# Altium project Analog.PrjPcb
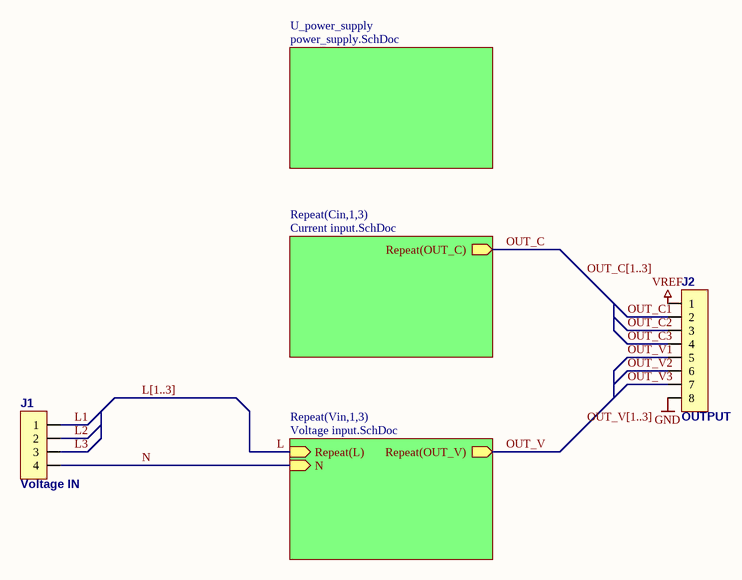
[diagram p0: main.SchDoc]
4 sheets, 89 parts. Net scope: hierarchical (ports join the sheet entries above them; power ports are global).
Sheets:
  main.SchDoc
    Cin1 = Current input.SchDoc
    Cin2 = Current input.SchDoc
    Cin3 = Current input.SchDoc
    U_power_supply = power_supply.SchDoc
    Vin1 = Voltage input.SchDoc
    Vin2 = Voltage input.SchDoc
    Vin3 = Voltage input.SchDoc

## Sheet main.SchDoc
size A4

### Parts
J1  Voltage IN  [2EDGRC-5.0-4P_WO_CN]
J2  OUTPUT  [GP_8x1]

### Sub-sheets
Repeat(Cin,1,3) = Current input.SchDoc: Repeat(OUT_C) (out)
Repeat(Vin,1,3) = Voltage input.SchDoc: Repeat(L) (in), N (in), Repeat(OUT_V) (out)
U_power_supply = power_supply.SchDoc: no entries

### Nets
GND: J2.8
VREF: J2.1
L: sheet Repeat(Vin,1,3)/Repeat(L)
L1: J1.1
L2: J1.2
L3: J1.3
N: J1.4 ; sheet Repeat(Vin,1,3)/N
OUT_C: sheet Repeat(Cin,1,3)/Repeat(OUT_C)
OUT_C1: J2.2
OUT_C2: J2.3
OUT_C3: J2.4
OUT_V: sheet Repeat(Vin,1,3)/Repeat(OUT_V)
OUT_V1: J2.5
OUT_V2: J2.6
OUT_V3: J2.7

### Buses and harness runs
bus L[1..3]
bus OUT_C[1..3]
bus OUT_V[1..3]

### Library data of the parts
J1 = 2EDGRC-5.0-4P: Degson 20A, 320V, 4 Pole Plug-in Terminal Block
J2 = CN_8x1

## Sheet Current input.SchDoc
size A4
Used 3 times, as channels Cin1, Cin2, Cin3. Parts and nets are listed once, with the designators drawn on the sheet.
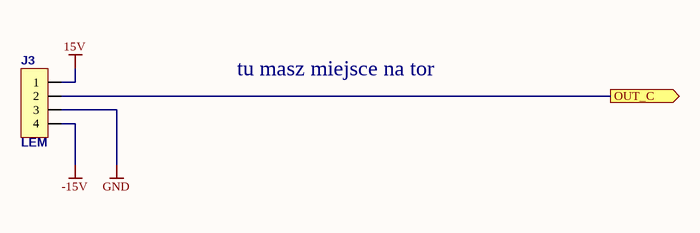
[diagram p1: Current input.SchDoc]

### Parts
J3  LEM  [15EDGRC-3.5/4P_WO_CN]

### Ports
OUT_C (out)

### Nets
15V: J3.1
-15V: J3.4
GND: J3.3
OUT_C: J3.2 ; port OUT_C

### Channels
Cin1: designators end in _Cin1; ports OUT_C=OUT_C1
Cin2: designators end in _Cin2; ports OUT_C=OUT_C2
Cin3: designators end in _Cin3; ports OUT_C=OUT_C3

### Notes on the sheet
- tu masz miejsce na tor

### Library data of the parts
J3 = 15EDGRC-3.5/4P: Degson 7A, 250V, 4 Pole Plug-in Terminal Block

## Sheet power_supply.SchDoc
size A4
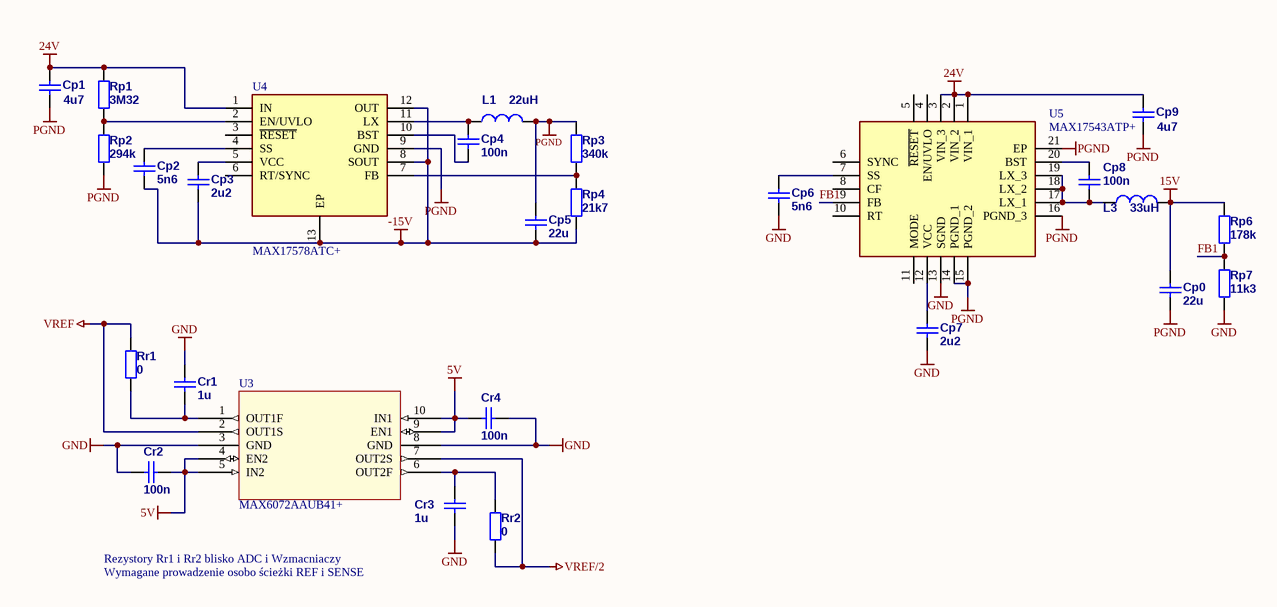
[diagram p2: power_supply.SchDoc]

### Parts
Cp0  22u  [C1206]
Cp1  4u7  [C1206]
Cp2  5n6  [C0603]
Cp3  2u2  [C0603]
Cp4  100n  [C0603]
Cp5  22u  [C1206]
Cp6  5n6  [C0603]
Cp7  2u2  [C0603]
Cp8  100n  [C0603]
Cp9  4u7  [C1206]
Cr1  1u  [C1206]
Cr2  100n  [C0805]
Cr3  1u  [C1206]
Cr4  100n  [C0805]
L1  22uH  [DE1205]
L3  33uH  [DE1205]
Rp1  3M32  [R0603]
Rp2  294k  [R0603]
Rp3  340k  [R0603]
Rp4  21k7  [R0603]
Rp6  178k  [R0603]
Rp7  11k3  [R0603]
Rr1  0  [R0402]
Rr2  0  [R0402]
U3  MAX6072AAUB41+  [21-0061L_MXM]
U4  MAX17578ATC+  [SON50P300X300X80-13N]
U5  MAX17543ATP+  [QFN50P400X400X80-21N]

### Nets
5V: Cr2.1 Cr4.2 U3.4(EN2) U3.5(IN2) U3.9(EN1) U3.10(IN1)
15V: Cp0.2 L3.2 Rp6.2
24V: Cp1.2 Cp9.2 Rp1.2 U4.1(IN) U5.1(VIN_1) U5.2(VIN_2) U5.3(VIN_3)
-15V: Cp2.1 Cp3.1 Cp5.1 Rp4.1 U4.8(SOUT) U4.12(OUT) U4.13(EP)
GND: Cp6.1 Cp7.1 Cr1.2 Cr2.2 Cr3.1 Cr4.1 Rp7.1 U3.3(GND) U3.8(GND) U5.13(SGND)
PGND: Cp0.1 Cp1.1 Cp5.2 Cp9.1 L1.2 Rp2.1 Rp3.2 U4.9(GND) U5.14(PGND_1) U5.15(PGND_2) U5.16(PGND_3) U5.21(EP)
VREF: Rr1.2 U3.2(OUT1S)
VREF/2: Rr2.1 U3.7(OUT2S)
FB1: Rp6.1 Rp7.2 U5.9(FB)
NetCp2_2: Cp2.2 U4.4(SS)
NetCp3_2: Cp3.2 U4.5(VCC)
NetCp4_1: Cp4.1 L1.1 U4.11(LX)
NetCp4_2: Cp4.2 U4.10(BST)
NetCp6_2: Cp6.2 U5.7(SS)
NetCp7_2: Cp7.2 U5.12(VCC)
NetCp8_1: Cp8.1 L3.1 U5.17(LX_1) U5.18(LX_2) U5.19(LX_3)
NetCp8_2: Cp8.2 U5.20(BST)
NetCr1_1: Cr1.1 Rr1.1 U3.1(OUT1F)
NetCr3_2: Cr3.2 Rr2.2 U3.6(OUT2F)
NetRp1_1: Rp1.1 Rp2.2 U4.2(EN/UVLO)
NetRp3_1: Rp3.1 Rp4.2 U4.7(FB)

Not connected (* = marked no-connect by the designer): U4 3(~{RESET}) 6(RT/SYNC); U5 4(EN/UVLO) 5(~{RESET}) 6(SYNC) 8(CF) 10(RT) 11(MODE)

### Notes on the sheet
- Rezystory Rr1 i Rr2 blisko ADC i Wzmacniaczy
- Wymagane prowadzenie osobo ścieżki REF i SENSE

### Library data of the parts
Cp0-Cp9 Cr1-Cr4 = Cap: Capacitor; ComponentLink1Description: datasheet; ComponentLink2Description: supplier
  Cp0 Cp5: Value: 22u
  Cp1 Cp9: Value: 4u7
  Cp2 Cp6: Value: 5n6
  Cp3 Cp7: Value: 2u2
  Cp4 Cp8 Cr2 Cr4: Value: 100n
  Cr1 Cr3: Value: 1u
L1 L3 = DE1205-22: Published: 08-Mar-2006; ComponentLink1Description: datasheet; ComponentLink2Description: supplier; Supplier 1: TME; Supplier Part Number 1: DE1205-22
  L1: Value: 22uH
  L3: Value: 33uH
Rp1-Rp4 Rp6 Rp7 Rr1 Rr2 = Res: Resistor; Published: 19-Feb-2006; ComponentLink1Description: datasheet; ComponentLink2Description: supplier
  Rp1: Value: 3M32
  Rp2: Value: 294k
  Rp3: Value: 340k
  Rp4: Value: 21k7
  Rp6: Value: 178k
  Rp7: Value: 11k3
  Rr1 Rr2: Value: 0
U3 = MAX6072AAUB41+: High-Precision, Dual-Output Series / Voltage Reference; Mfr_Name: Maxim Integrated Products; Manufacturer_Part_Number: MAX6072AAUB25+; Copyright: Copyright (C) 2022 Ultra Librarian. All rights reserved.; RefDes: RefDes; Type: DEV
U4 = MAX17578ATC+: Integrated Circuit; Manufacturer_Name: Maxim Integrated; Datasheet Link: https://datasheets.maximintegrated.com/en/ds/MAX17577-MAX17578.pdf; Height: 0.8mm; Manufacturer_Part_Number: MAX17578ATC+
U5 = MAX17543ATP+: Integrated Circuit; Manufacturer_Name: Maxim Integrated; Datasheet Link: https://pdfserv.maximintegrated.com/en/ds/MAX17543.pdf; Height: 0.8mm; Manufacturer_Part_Number: MAX17543ATP+

## Sheet Voltage input.SchDoc
size 431 x 279 mm; SheetNumber: 1; SheetTotal: 5
Used 3 times, as channels Vin1, Vin2, Vin3. Parts and nets are listed once, with the designators drawn on the sheet.
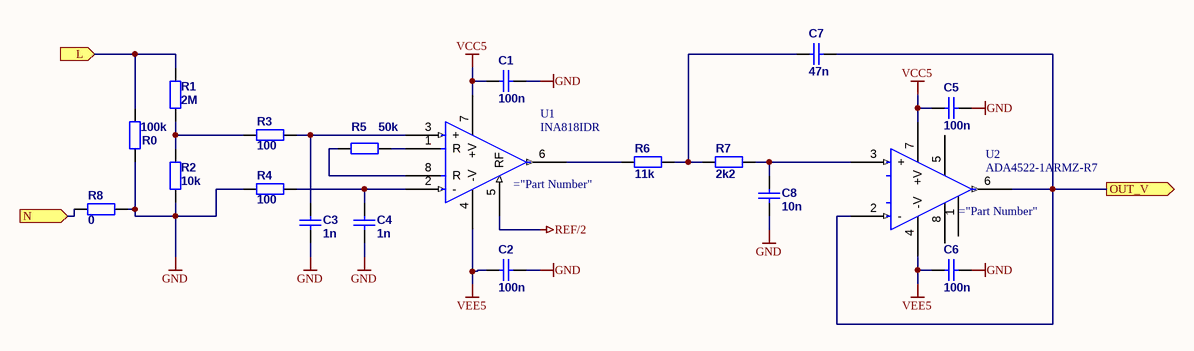
[diagram p3: Voltage input.SchDoc]

### Parts
C1  100n  [C0805]
C2  100n  [C0805]
C3  1n  [C1206]
C4  1n  [C1206]
C5  100n  [C0805]
C6  100n  [C0805]
C7  47n  [C0805]
C8  10n  [C0805]
R0  100k  [R2512]
R1  2M  [R1206]
R2  10k  [R1206]
R3  100  [R1206]
R4  100  [R1206]
R5  50k  [R0805]
R6  11k  [R0805]
R7  2k2  [R0805]
R8  0  [R1206]
U1  INA818IDR  [SOIC-8_TEX]
U2  ADA4522-1ARMZ-R7  [Analog_Devices_RM-8_IPC_C]

### Ports
L (in), N (in), OUT_V (out)

### Nets
GND: C1.2 C2.1 C3.1 C4.1 C5.1 C6.2 C8.2 R0.1 R2.2 R4.1 R8.2
REF/2: U1.5(RF)
VCC5: C1.1 C5.2 U1.7(+V) U2.7(+V)
VEE5: C2.2 C6.1 U1.4(-V) U2.4(-V)
L: R0.2 R1.1 ; port L
N: R8.1 ; port N
OUT_V: C7.1 U2.2(-) U2.6(OUT) ; port OUT_V
NetC3_2: C3.2 R3.2 U1.3(+)
NetC4_2: C4.2 R4.2 U1.2(-)
NetC7_2: C7.2 R6.2 R7.1
NetC8_1: C8.1 R7.2 U2.3(+)
NetR1_2: R1.2 R2.1 R3.1
NetR5_1: R5.1 U1.8(R)
NetR5_2: R5.2 U1.1(R)
NetR6_1: R6.1 U1.6(OUT)

Not connected (* = marked no-connect by the designer): U2 1 5 8

### Channels
Vin1: designators end in _Vin1; ports L=L1 N=N OUT_V=OUT_V1
Vin2: designators end in _Vin2; ports L=L2 N=N OUT_V=OUT_V2
Vin3: designators end in _Vin3; ports L=L3 N=N OUT_V=OUT_V3

### Notes on the sheet
- DWG. NO.
- REV.
- SHT.
- THIS DOCUMENT AND THE DATA DISCLOSED HEREIN OR HEREWITH IS THE PROPERTY OF ALTIUM LIMITED AND MAY BE FREELY DISTRIBUTED IN WHOLE. NO RIGHTS ARE RESERVED OR EXPRESS OR IMPLIED WARANTEE GIVEN.
- REVISION
- DESCRIPTION
- DATE
- APPROVED
- ENG:
- APPROVALS
- PROJECT
- DSN:
- CHK:
- REFERENCE DOCUMENTS
- PROJECT REVISION:
- TITLE
- DOCUMENT REVISION:
- DESIGN ITEM:
- BOM:
- FAB DWG:
- PCB DWG:
- ASSY DWG:
- SCALE:
- SIZE
- B
- CAGE CODE
- FILE NAME
- DWG NO.
- SHEET
- OF
- REV

### Library data of the parts
C1-C8 = Cap: Capacitor; ComponentLink1Description: datasheet; ComponentLink2Description: supplier
  C1 C2 C5 C6: Value: 100n
  C3 C4: Value: 1n
  C7: Value: 47n
  C8: Value: 10n
R0-R8 = Res: Resistor; Published: 19-Feb-2006; ComponentLink1Description: datasheet; ComponentLink2Description: supplier
  R0: Value: 100k
  R1: Value: 2M
  R2: Value: 10k
  R3 R4: Value: 100
  R5: Value: 50k
  R6: Value: 11k
  R7: Value: 2k2
  R8: Value: 0
U1 = INA818IDR: No Description Available; Mfr_Name: Texas Instruments; Copyright: Copyright (C) 2021 Ultra Librarian. All rights reserved.; Manufacturer_Part_Number: INA818IDR; RefDes: RefDes; Type: DEV

## Nets that join several sheets
15V: Cin1 (J3_Cin1.1), Cin2 (J3_Cin2.1), Cin3 (J3_Cin3.1), power_supply (Cp0.2 L3.2 Rp6.2)
-15V: Cin1 (J3_Cin1.4), Cin2 (J3_Cin2.4), Cin3 (J3_Cin3.4), power_supply (7 pins)
GND: main (J2.8), Cin1 (J3_Cin1.3), Cin2 (J3_Cin2.3), Cin3 (J3_Cin3.3), power_supply (10 pins), Vin1 (11 pins), Vin2 (11 pins), Vin3 (11 pins)
REF/2: Vin1 (U1_Vin1.5), Vin2 (U1_Vin2.5), Vin3 (U1_Vin3.5)
VCC5: Vin1 (C1_Vin1.1 C5_Vin1.2 U1_Vin1.7 U2_Vin1.7), Vin2 (C1_Vin2.1 C5_Vin2.2 U1_Vin2.7 U2_Vin2.7), Vin3 (C1_Vin3.1 C5_Vin3.2 U1_Vin3.7 U2_Vin3.7)
VEE5: Vin1 (C2_Vin1.2 C6_Vin1.1 U1_Vin1.4 U2_Vin1.4), Vin2 (C2_Vin2.2 C6_Vin2.1 U1_Vin2.4 U2_Vin2.4), Vin3 (C2_Vin3.2 C6_Vin3.1 U1_Vin3.4 U2_Vin3.4)
VREF: main (J2.1), power_supply (Rr1.2 U3.2)
L1: main (J1.1), Vin1 (R0_Vin1.2 R1_Vin1.1)
L2: main (J1.2), Vin2 (R0_Vin2.2 R1_Vin2.1)
L3: main (J1.3), Vin3 (R0_Vin3.2 R1_Vin3.1)
N: main (J1.4), Vin1 (R8_Vin1.1), Vin2 (R8_Vin2.1), Vin3 (R8_Vin3.1)
OUT_C1: main (J2.2), Cin1 (J3_Cin1.2)
OUT_C2: main (J2.3), Cin2 (J3_Cin2.2)
OUT_C3: main (J2.4), Cin3 (J3_Cin3.2)
OUT_V1: main (J2.5), Vin1 (C7_Vin1.1 U2_Vin1.2 U2_Vin1.6)
OUT_V2: main (J2.6), Vin2 (C7_Vin2.1 U2_Vin2.2 U2_Vin2.6)
OUT_V3: main (J2.7), Vin3 (C7_Vin3.1 U2_Vin3.2 U2_Vin3.6)